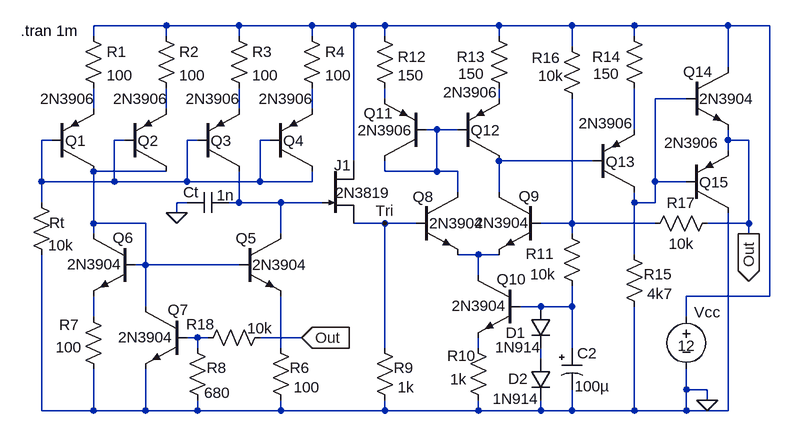
[diagram p0: schematic SqrWavDiscretGen.asc]
SqrWavDiscretGen.asc, the LTspice schematic file:
Version 4
SHEET 1 1216 680
WIRE 240 -32 128 -32
WIRE 352 -32 240 -32
WIRE 464 -32 352 -32
WIRE 528 -32 464 -32
WIRE 576 -32 528 -32
WIRE 752 -32 576 -32
WIRE 864 -32 752 -32
WIRE 960 -32 864 -32
WIRE 1104 -32 960 -32
WIRE 1168 -32 1104 -32
WIRE 128 -16 128 -32
WIRE 240 -16 240 -32
WIRE 352 -16 352 -32
WIRE 464 -16 464 -32
WIRE 576 -16 576 -32
WIRE 752 -16 752 -32
WIRE 960 -16 960 -32
WIRE 864 0 864 -32
WIRE 1104 32 1104 -32
WIRE 576 80 576 64
WIRE 752 80 752 64
WIRE 1040 80 992 80
WIRE 128 96 128 64
WIRE 240 96 240 64
WIRE 352 96 352 64
WIRE 464 96 464 64
WIRE 656 128 640 128
WIRE 688 128 656 128
WIRE 960 128 960 64
WIRE 64 144 48 144
WIRE 176 144 160 144
WIRE 288 144 272 144
WIRE 400 144 384 144
WIRE 1104 144 1104 128
WIRE 1136 144 1104 144
WIRE 1104 160 1104 144
WIRE 528 176 528 -32
WIRE 896 176 752 176
WIRE 240 192 128 192
WIRE 576 192 576 176
WIRE 656 192 656 128
WIRE 656 192 576 192
WIRE 688 192 656 192
WIRE 48 208 48 144
WIRE 160 208 160 144
WIRE 160 208 48 208
WIRE 272 208 272 144
WIRE 272 208 160 208
WIRE 384 208 384 144
WIRE 384 208 272 208
WIRE 464 208 464 192
WIRE 464 208 384 208
WIRE 992 208 992 80
WIRE 1040 208 992 208
WIRE 688 224 688 192
WIRE 752 224 752 176
WIRE 48 240 48 208
WIRE 272 240 256 240
WIRE 352 240 352 192
WIRE 352 240 336 240
WIRE 416 240 352 240
WIRE 480 240 416 240
WIRE 960 240 960 224
WIRE 992 240 992 208
WIRE 992 240 960 240
WIRE 256 256 256 240
WIRE 128 272 128 192
WIRE 208 272 128 272
WIRE 576 272 528 272
WIRE 624 272 576 272
WIRE 864 272 864 80
WIRE 864 272 816 272
WIRE 992 272 864 272
WIRE 1136 272 1136 144
WIRE 1136 272 1072 272
WIRE 128 288 128 272
WIRE 416 288 416 240
WIRE 864 288 864 272
WIRE 1136 288 1136 272
WIRE 720 320 688 320
WIRE 752 320 720 320
WIRE 960 320 960 240
WIRE 208 336 208 272
WIRE 208 336 192 336
WIRE 352 336 208 336
WIRE 720 352 720 320
WIRE 1168 384 1168 -32
WIRE 1168 384 1040 384
WIRE 208 400 208 336
WIRE 816 400 784 400
WIRE 864 400 864 368
WIRE 864 400 816 400
WIRE 128 416 128 384
WIRE 1040 416 1040 384
WIRE 288 448 272 448
WIRE 304 448 288 448
WIRE 448 448 384 448
WIRE 288 464 288 448
WIRE 416 464 416 384
WIRE 576 464 576 272
WIRE 720 464 720 448
WIRE 864 464 864 400
WIRE 816 480 816 464
WIRE 1040 528 1040 496
WIRE 1072 528 1040 528
WIRE 1072 544 1072 528
WIRE 48 560 48 320
WIRE 128 560 128 496
WIRE 128 560 48 560
WIRE 208 560 208 496
WIRE 208 560 128 560
WIRE 288 560 288 544
WIRE 288 560 208 560
WIRE 416 560 416 544
WIRE 416 560 288 560
WIRE 576 560 576 544
WIRE 576 560 416 560
WIRE 720 560 720 544
WIRE 720 560 576 560
WIRE 816 560 816 544
WIRE 816 560 720 560
WIRE 864 560 864 528
WIRE 864 560 816 560
WIRE 960 560 960 400
WIRE 960 560 864 560
WIRE 1040 560 1040 528
WIRE 1040 560 960 560
WIRE 1104 560 1104 256
WIRE 1104 560 1040 560
FLAG 1072 544 0
FLAG 256 256 0
FLAG 448 448 Out
IOPIN 448 448 In
FLAG 1136 288 Out
IOPIN 1136 288 Out
FLAG 576 272 Tri
SYMBOL pnp2 64 192 M180
WINDOW 0 20 47 Left 0
WINDOW 3 -18 112 Left 0
SYMATTR InstName Q1
SYMATTR Value 2N3906
SYMBOL res 112 -32 R0
SYMATTR InstName R1
SYMATTR Value 100
SYMBOL pnp2 176 192 M180
WINDOW 0 20 47 Left 0
WINDOW 3 -18 112 Left 0
SYMATTR InstName Q2
SYMATTR Value 2N3906
SYMBOL res 224 -32 R0
SYMATTR InstName R2
SYMATTR Value 100
SYMBOL pnp2 288 192 M180
WINDOW 0 20 47 Left 0
WINDOW 3 -18 112 Left 0
SYMATTR InstName Q3
SYMATTR Value 2N3906
SYMBOL res 336 -32 R0
SYMATTR InstName R3
SYMATTR Value 100
SYMBOL pnp2 400 192 M180
WINDOW 0 20 47 Left 0
WINDOW 3 -18 112 Left 0
SYMATTR InstName Q4
SYMATTR Value 2N3906
SYMBOL res 448 -32 R0
SYMATTR InstName R4
SYMATTR Value 100
SYMBOL res 32 224 R0
WINDOW 0 28 47 Left 0
WINDOW 3 26 82 Left 0
SYMATTR InstName Rt
SYMATTR Value 10k
SYMBOL npn2 352 288 R0
WINDOW 0 -5 7 Left 0
WINDOW 3 20 48 Left 0
SYMATTR InstName Q5
SYMATTR Value 2N3904
SYMBOL res 400 448 R0
WINDOW 0 30 46 Left 0
SYMATTR InstName R6
SYMATTR Value 100
SYMBOL npn2 192 288 M0
WINDOW 0 2 6 Left 0
WINDOW 3 20 47 Left 0
SYMATTR InstName Q6
SYMATTR Value 2N3904
SYMBOL res 112 400 R0
WINDOW 0 -37 28 Left 0
WINDOW 3 -42 63 Left 0
SYMATTR InstName R7
SYMATTR Value 100
SYMBOL npn2 272 400 M0
WINDOW 0 -2 5 Left 0
WINDOW 3 21 47 Left 0
SYMATTR InstName Q7
SYMATTR Value 2N3904
SYMBOL cap 336 224 R90
WINDOW 0 16 58 VBottom 0
WINDOW 3 -11 5 VTop 0
SYMATTR InstName Ct
SYMATTR Value 1n
SYMBOL res 272 448 R0
WINDOW 0 30 46 Left 0
WINDOW 3 26 85 Left 0
SYMATTR InstName R8
SYMATTR Value 680
SYMBOL njf 480 176 R0
WINDOW 0 18 7 Left 0
WINDOW 3 20 49 Left 0
SYMATTR InstName J1
SYMATTR Value 2N3819
SYMBOL res 560 448 R0
WINDOW 0 30 46 Left 0
SYMATTR InstName R9
SYMATTR Value 1k
SYMBOL npn2 624 224 R0
WINDOW 0 -5 7 Left 0
WINDOW 3 20 48 Left 0
SYMATTR InstName Q8
SYMATTR Value 2N3904
SYMBOL npn2 816 224 M0
WINDOW 0 2 6 Left 0
WINDOW 3 17 47 Left 0
SYMATTR InstName Q9
SYMATTR Value 2N3904
SYMBOL npn2 784 352 M0
WINDOW 0 -10 6 Left 0
WINDOW 3 20 47 Left 0
SYMATTR InstName Q10
SYMATTR Value 2N3904
SYMBOL res 704 448 R0
WINDOW 0 -32 28 Left 0
WINDOW 3 -27 64 Left 0
SYMATTR InstName R10
SYMATTR Value 1k
SYMBOL diode 800 400 R0
WINDOW 0 -38 40 Left 0
WINDOW 3 -54 63 Left 0
SYMATTR InstName D1
SYMATTR Value 1N914
SYMBOL diode 800 480 R0
WINDOW 0 -34 31 Left 0
WINDOW 3 -58 62 Left 0
SYMATTR InstName D2
SYMATTR Value 1N914
SYMBOL polcap 848 464 R0
WINDOW 3 20 59 Left 0
SYMATTR Value 100µ
SYMATTR InstName C2
SYMATTR Description Capacitor
SYMATTR Type cap
SYMATTR SpiceLine V=6.3 Irms=3 Rser=0.015 MTBF=1000 Lser=0 mfg="Panasonic" pn="EEFUD0J101R" type="Al electrolytic" ppPkg=1
SYMBOL res 848 272 R0
WINDOW 0 -55 47 Left 0
WINDOW 3 -48 78 Left 0
SYMATTR InstName R11
SYMATTR Value 10k
SYMBOL pnp2 640 176 R180
WINDOW 0 51 73 Left 0
WINDOW 3 21 47 Left 0
SYMATTR InstName Q11
SYMATTR Value 2N3906
SYMBOL res 560 -32 R0
WINDOW 0 36 48 Left 0
SYMATTR InstName R12
SYMATTR Value 150
SYMBOL pnp2 688 176 M180
WINDOW 0 20 47 Left 0
WINDOW 3 -22 106 Left 0
SYMATTR InstName Q12
SYMATTR Value 2N3906
SYMBOL res 736 -32 R0
WINDOW 0 -49 48 Left 0
WINDOW 3 -47 74 Left 0
SYMATTR InstName R13
SYMATTR Value 150
SYMBOL pnp2 896 224 M180
WINDOW 0 20 47 Left 0
WINDOW 3 -22 106 Left 0
SYMATTR InstName Q13
SYMATTR Value 2N3906
SYMBOL res 944 -32 R0
WINDOW 0 -49 48 Left 0
WINDOW 3 -47 74 Left 0
SYMATTR InstName R14
SYMATTR Value 150
SYMBOL res 944 304 R0
WINDOW 0 30 46 Left 0
SYMATTR InstName R15
SYMATTR Value 4k7
SYMBOL npn2 1040 32 R0
WINDOW 0 -5 7 Left 0
WINDOW 3 20 48 Left 0
SYMATTR InstName Q14
SYMATTR Value 2N3904
SYMBOL pnp2 1040 256 M180
WINDOW 0 20 47 Left 0
WINDOW 3 -34 108 Left 0
SYMATTR InstName Q15
SYMATTR Value 2N3906
SYMBOL res 848 -16 R0
WINDOW 0 -46 33 Left 0
WINDOW 3 -36 61 Left 0
SYMATTR InstName R16
SYMATTR Value 10k
SYMBOL res 1088 256 R90
WINDOW 0 0 56 VBottom 0
WINDOW 3 32 56 VTop 0
SYMATTR InstName R17
SYMATTR Value 10k
SYMBOL res 400 432 R90
WINDOW 0 11 107 VBottom 0
WINDOW 3 -14 16 VTop 0
SYMATTR InstName R18
SYMATTR Value 10k
SYMBOL voltage 1040 400 R0
WINDOW 0 12 9 Left 0
WINDOW 3 -13 60 Left 0
SYMATTR InstName Vcc
SYMATTR Value 12
TEXT 16 -24 Left 0 !.tran 1m

The netlist it stands for:
* SqrWavDiscretGen.asc
Q1 N013 N011 N005 0 2N3906
R1 N001 N005 100
Q2 N013 N011 N006 0 2N3906
R2 N001 N006 100
Q3 N014 N011 N007 0 2N3906
R3 N001 N007 100
Q4 N011 N011 N008 0 2N3906
R4 N001 N008 100
Rt N011 0 10k
Q5 N014 N013 N020 0 2N3904
R6 N020 0 100
Q6 N013 N013 N018 0 2N3904
R7 N018 0 100
Q7 N013 N019 0 0 2N3904
Ct N014 0 1n
R8 N019 0 680
J1 N001 N014 Tri 2N3819
R9 Tri 0 1k
Q8 N009 Tri N016 0 2N3904
Q9 N012 N015 N016 0 2N3904
Q10 N016 N017 N021 0 2N3904
R10 N021 0 1k
D1 N017 N022 1N914
D2 N022 0 1N914
C2 N017 0 100µ V=6.3 Irms=3 Rser=0.015 MTBF=1000 Lser=0 mfg="Panasonic" pn="EEFUD0J101R" type="Al electrolytic" ppPkg=1
R11 N015 N017 10k
Q11 N009 N009 N002 0 2N3906
R12 N001 N002 150
Q12 N012 N009 N003 0 2N3906
R13 N001 N003 150
Q13 N004 N012 N010 0 2N3906
R14 N001 N010 150
R15 N004 0 4k7
Q14 N001 N004 Out 0 2N3904
Q15 0 N004 Out 0 2N3906
R16 N001 N015 10k
R17 Out N015 10k
R18 Out N019 10k
Vcc N001 0 12
.model D D
.lib standard.dio
.model NPN NPN
.model PNP PNP
.lib standard.bjt
.model NJF NJF
.model PJF PJF
.lib standard.jft
.tran 1m
.backanno
.end